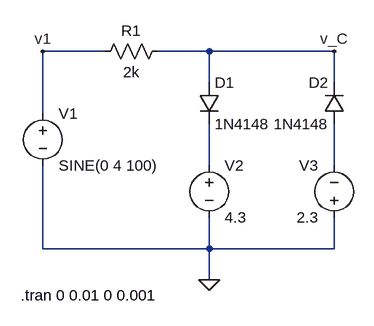
[diagram p0: schematic ej1_1.asc]
ej1_1.asc, the LTspice schematic file:
Version 4
SHEET 1 880 680
WIRE 144 0 48 0
WIRE 304 0 224 0
WIRE 496 0 304 0
WIRE 304 48 304 0
WIRE 496 48 496 0
WIRE 48 96 48 0
WIRE 304 176 304 112
WIRE 496 176 496 112
WIRE 48 304 48 176
WIRE 304 304 304 256
WIRE 304 304 48 304
WIRE 496 304 496 256
WIRE 496 304 304 304
WIRE 304 352 304 304
FLAG 496 0 v_C
FLAG 304 352 0
FLAG 48 0 v1
SYMBOL voltage 48 80 R0
WINDOW 123 0 0 Left 2
WINDOW 39 0 0 Left 2
SYMATTR InstName V1
SYMATTR Value SINE(0 4 100)
SYMBOL res 240 -16 R90
WINDOW 0 0 56 VBottom 2
WINDOW 3 32 56 VTop 2
SYMATTR InstName R1
SYMATTR Value 2k
SYMBOL diode 288 48 R0
SYMATTR InstName D1
SYMATTR Value 1N4148
SYMBOL diode 512 112 R180
WINDOW 0 24 64 Left 2
WINDOW 3 24 0 Left 2
SYMATTR InstName D2
SYMATTR Value 1N4148
SYMBOL voltage 304 160 R0
WINDOW 123 0 0 Left 2
WINDOW 39 0 0 Left 2
SYMATTR InstName V2
SYMATTR Value 4.3
SYMBOL voltage 496 272 R180
WINDOW 0 24 96 Left 2
WINDOW 3 24 16 Left 2
WINDOW 123 0 0 Left 2
WINDOW 39 0 0 Left 2
SYMATTR InstName V3
SYMATTR Value 2.3
TEXT 14 376 Left 2 !.tran 0 0.01 0 0.001

The netlist it stands for:
* ej1_1.asc
V1 v1 0 SINE(0 4 100)
R1 v_C v1 2k
D1 v_C N001 1N4148
D2 N002 v_C 1N4148
V2 N001 0 4.3
V3 0 N002 2.3
.model D D
.lib standard.dio
.tran 0 0.01 0 0.001
.backanno
.end